# Altium schematic sheet LSM9DS0.SchDoc
size A4
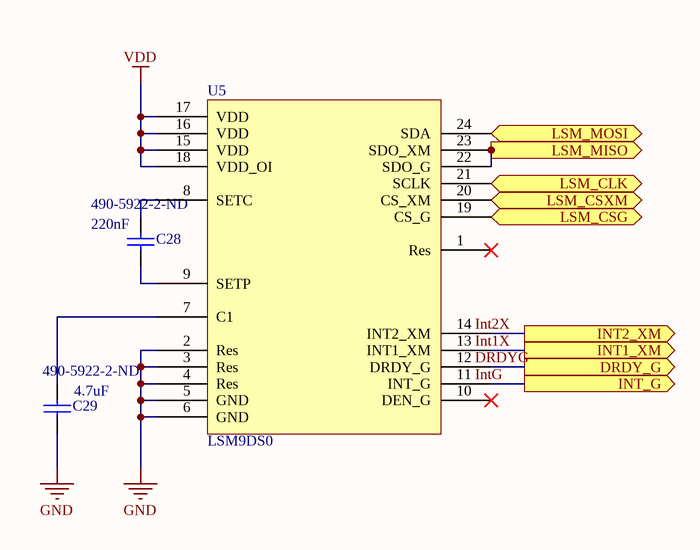
[diagram p0: LSM9DS0.SchDoc]

## Parts
C28  value 220nF  Supplier Part Number 1: 490-5922-2-ND  [0402]  (hidden comment: Cap Semi)
C29  value 4.7uF  Supplier Part Number 1: 490-5922-2-ND  [0402]  (hidden comment: Cap Semi)
U5  Component_1  [PCBComponent_1]  (value not drawn)

## Ports
DRDY_G (out), INT1_XM (out), INT2_XM (out), INT_G (out), LSM_CLK (in), LSM_CSG (in), LSM_CSXM (in), LSM_MISO (out), LSM_MOSI (in)

## Nets
GND: C29.1 U5.2(Res) U5.3(Res) U5.4(Res) U5.5(GND) U5.6(GND)
VDD: U5.15(VDD) U5.16(VDD) U5.17(VDD) U5.18(VDD_OI)
DRDY_G: U5.12(DRDY_G) ; port DRDY_G
INT1_XM: U5.13(INT1_XM) ; port INT1_XM
INT2_XM: U5.14(INT2_XM) ; port INT2_XM
INT_G: U5.11(INT_G) ; port INT_G
LSM_CLK: U5.21(SCLK) ; port LSM_CLK
LSM_CSG: U5.19(CS_G) ; port LSM_CSG
LSM_CSXM: U5.20(CS_XM) ; port LSM_CSXM
LSM_MISO: U5.22(SDO_G) U5.23(SDO_XM) ; port LSM_MISO
LSM_MOSI: U5.24(SDA) ; port LSM_MOSI
NetC28_1: C28.1 U5.9(SETP)
NetC28_2: C28.2 U5.8(SETC)
NetC29_2: C29.2 U5.7(C1)

Not connected (* = marked no-connect by the designer): U5 1(Res)* 10(DEN_G)*

## Notes on the sheet
- Labels drawn without touching a wire or pin: DRDYG, Int1X, Int2X, IntG
- (in symbol Component_1) LSM9DS0

## Library data of the parts
C28 C29 = Cap Semi: Capacitor (Semiconductor SIM Model); Published: 8-Jun-2000; LatestRevisionDate: 29-May-2009; LatestRevisionNote: IPC-7351 Footprint Added.; PackageReference: C1206; Publisher: Altium Limited; PackageDescription: Chip Capacitor; Supplier 1: Digi-Key